# EAGLE design PiUnitTest (EAGLE 7.4.0)
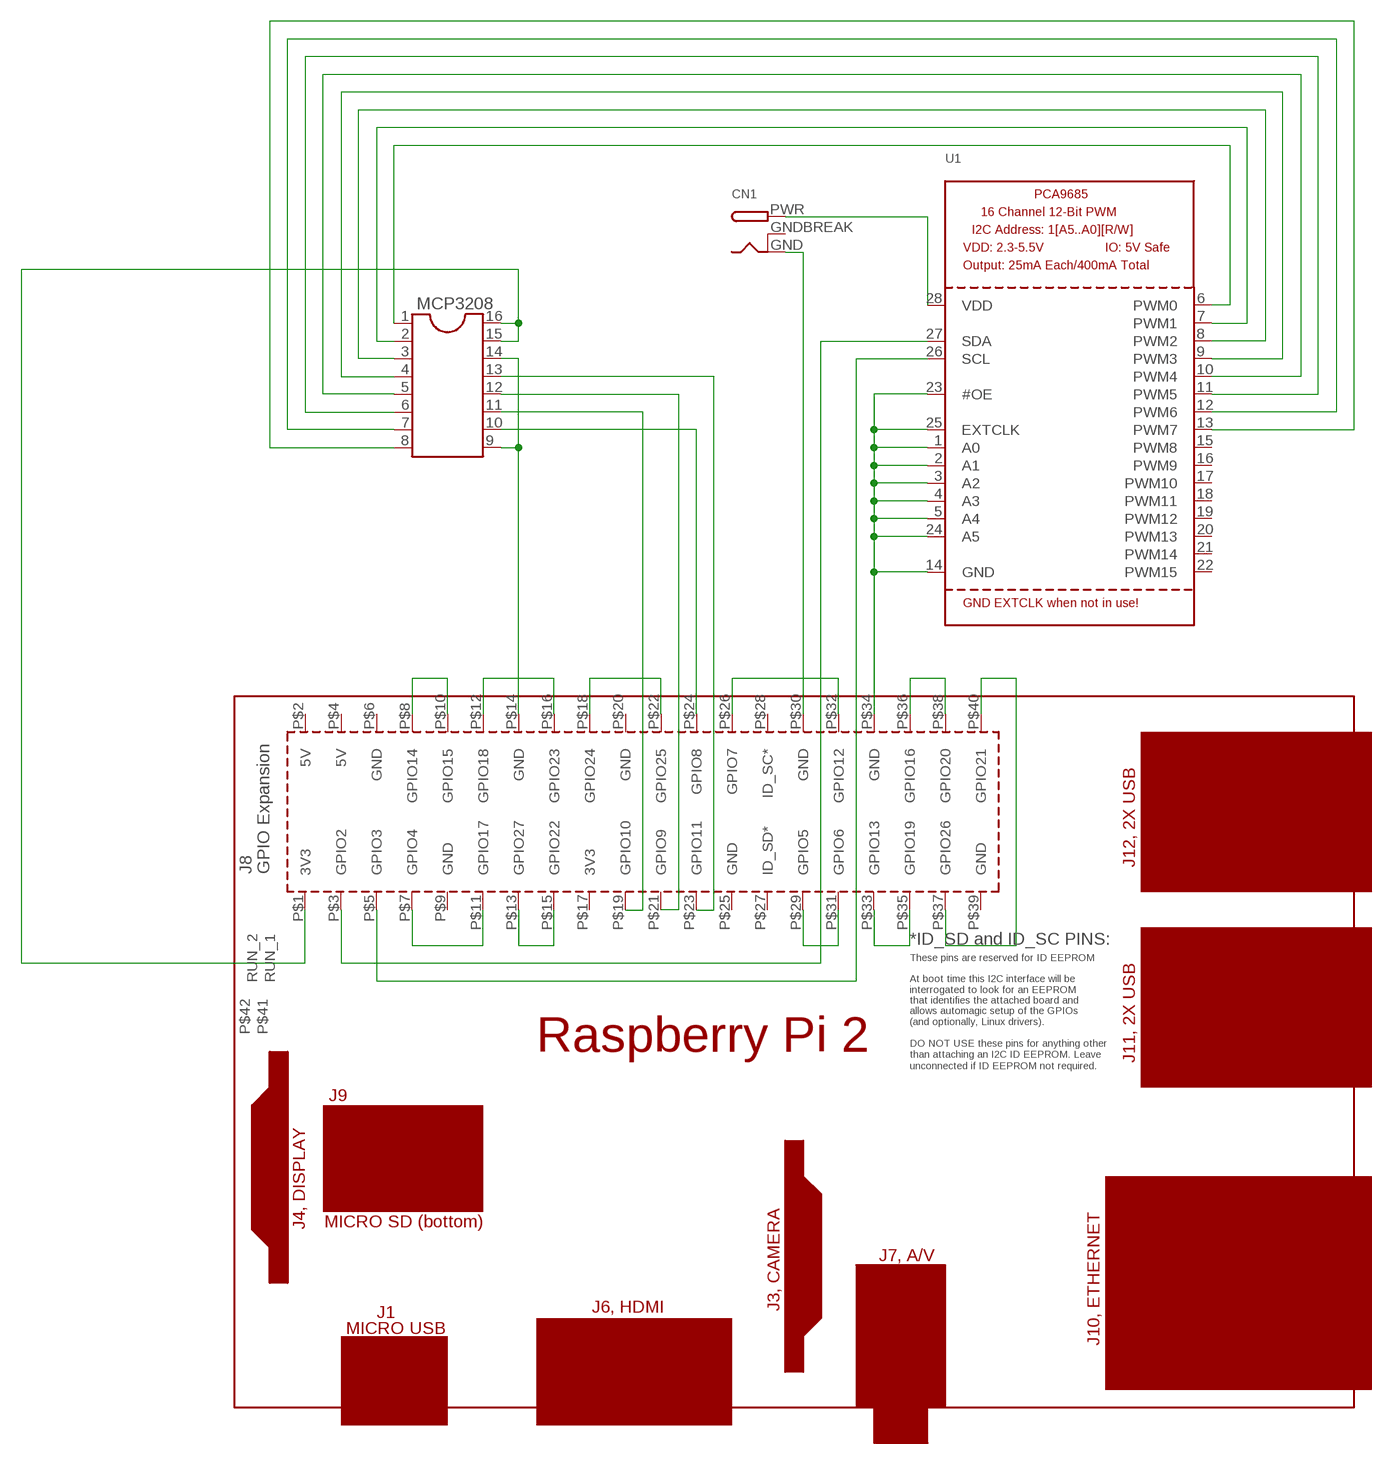
[diagram p0: schematic, sheet 1]

## Parts
CN1  DCBARRELPTH  [DCJACK_2MM_PTH]
MCP3208  DIL16  [DIL16]
PCB1  RPI2  [RPI2]
U1  PCA9685  [TSSOP28]

## Nets
N$1: CN1.GND PCB1.P$30(GND)
N$2: MCP3208.9 MCP3208.14 PCB1.P$14(GND)
N$3: PCB1.P$34(GND) U1.1(A0) U1.2(A1) U1.3(A2) U1.4(A3) U1.5(A4) U1.14(GND) U1.23(#OE) U1.24(A5) U1.25(EXTCLK)
N$4: MCP3208.15 MCP3208.16 PCB1.P$1(3V3)
N$5: MCP3208.13 PCB1.P$23(GPIO11)
N$6: MCP3208.12 PCB1.P$21(GPIO9)
N$7: MCP3208.11 PCB1.P$19(GPIO10)
N$8: MCP3208.10 PCB1.P$24(GPIO8)
N$9: CN1.PWR U1.28(VDD)
N$10: PCB1.P$3(GPIO2) U1.27(SDA)
N$11: PCB1.P$5(GPIO3) U1.26(SCL)
N$12: MCP3208.1 U1.6(PWM0)
N$13: MCP3208.2 U1.7(PWM1)
N$14: MCP3208.3 U1.8(PWM2)
N$15: MCP3208.4 U1.9(PWM3)
N$16: MCP3208.5 U1.10(PWM4)
N$17: MCP3208.6 U1.11(PWM5)
N$18: MCP3208.7 U1.12(PWM6)
N$19: MCP3208.8 U1.13(PWM7)
N$20: PCB1.P$7(GPIO4) PCB1.P$11(GPIO17)
N$21: PCB1.P$13(GPIO27) PCB1.P$15(GPIO22)
N$22: PCB1.P$29(GPIO5) PCB1.P$31(GPIO6)
N$23: PCB1.P$33(GPIO13) PCB1.P$35(GPIO19)
N$24: PCB1.P$37(GPIO26) PCB1.P$40(GPIO21)
N$25: PCB1.P$36(GPIO16) PCB1.P$38(GPIO20)
N$26: PCB1.P$26(GPIO7) PCB1.P$32(GPIO12)
N$27: PCB1.P$18(GPIO24) PCB1.P$22(GPIO25)
N$28: PCB1.P$12(GPIO18) PCB1.P$16(GPIO23)
N$29: PCB1.P$8(GPIO14) PCB1.P$10(GPIO15)
Unconnected: PCB1.P$2(5V) PCB1.P$4(5V) PCB1.P$6(GND) PCB1.P$9(GND) PCB1.P$17(3V3) PCB1.P$20(GND) PCB1.P$25(GND) PCB1.P$27(ID_SD*) PCB1.P$28(ID_SC*) PCB1.P$39(GND) PCB1.P$41(RUN_1) PCB1.P$42(RUN_2) U1.15(PWM8) U1.16(PWM9) U1.17(PWM10) U1.18(PWM11) U1.19(PWM12) U1.20(PWM13) U1.21(PWM14) U1.22(PWM15)

## Power pins joined to a net without a drawn wire
GNDBREAK: CN1.GNDBREAK

## Library data of the parts
CN1 = adafruit:DCBARREL: 2.0mm DC Barrel Jack DCJACK_2MM_PTH - Through Hole Jack (4UConnector: 05537)
MCP3208 = ic-package:DIL16: Dual In Line / Socket
PCB1 = e14_Rpi2_RevA:RPI2: Device for Raspberry Pi 2 board created by www.element14.com More information and support community is available at http://www.element14.com/community/community/raspberry-pi/raspberrypi2
U1 = adafruit:PCA9685: PCA9685 - 16 Channel 12-Bit I2C PWM Controller 5.0V tolerant 16 channel, 12-bit I2C PWM controller with 25mA per output (max. 400mA total) Digikey: 568-5931-1-ND

## Board
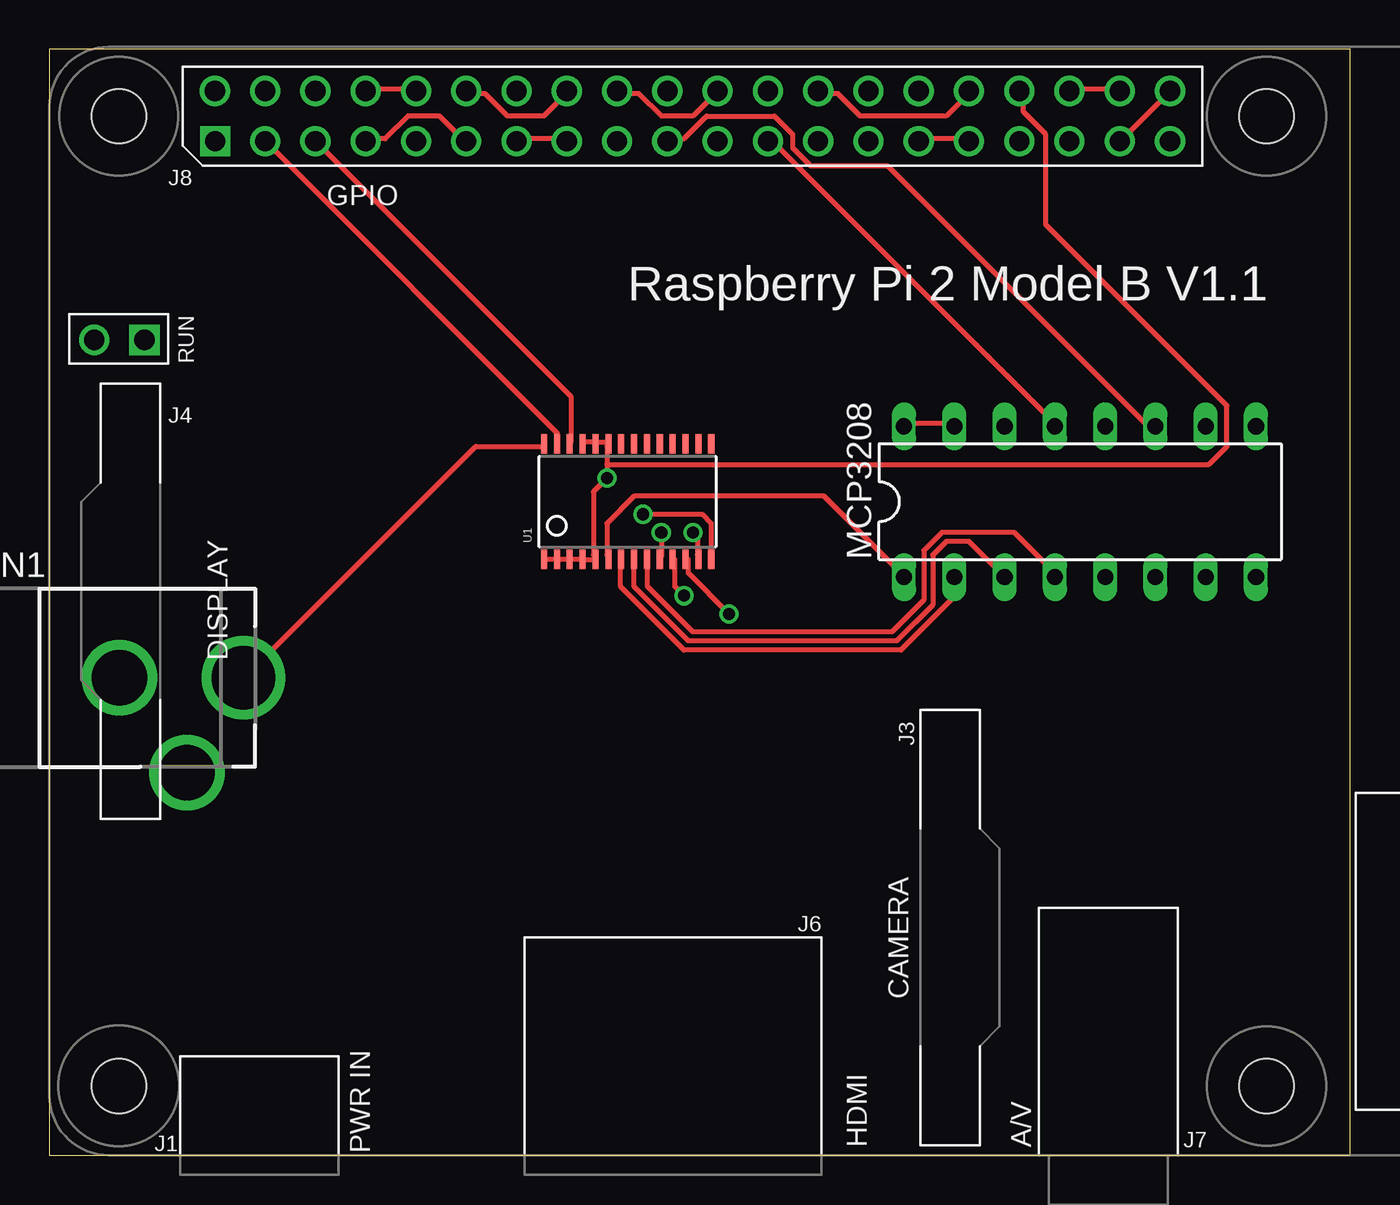
[diagram p1: board, top side]
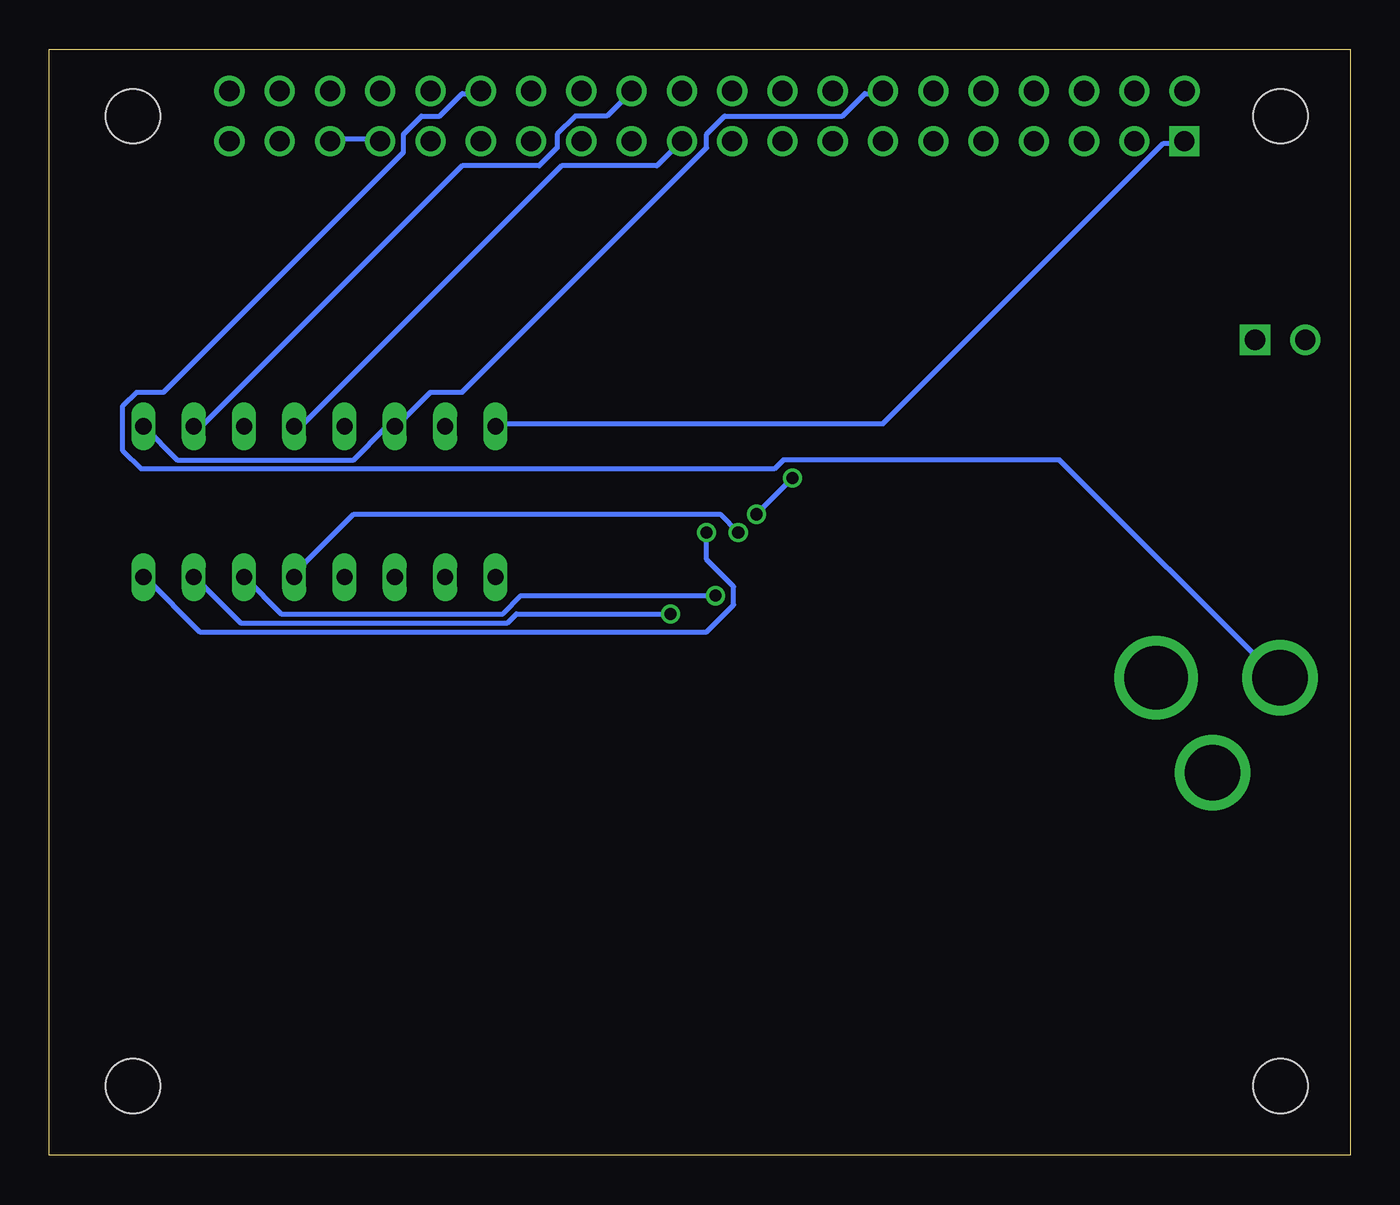
[diagram p2: board, bottom side, seen from below]

Size 65.71 x 55.87 mm. Coordinates in mm from the lower left corner, seen from the top.
Outline: 0,0 65.71,0 65.71,55.87 0,55.87 0,0
Copper layers (1*16): Top 0.0356mm / dielectric 1.5011mm / Bottom 0.0356mm
Design rules "LaenPCBOrder": minimum track width 6mil, minimum drill 13mil, track to track 6mil, track to pad 6mil, pad to pad 6mil, via to via 6mil, smd to smd 6mil, copper to edge 15mil, drill to drill 6mil, minimum pad ring 7mil, minimum via ring 7mil, stop-mask expansion 3mil, vias tented up to drill 0mil, thermal gap 10mil

### Footprints (pad centres in the part's own frame; a part is rotated, then mirrored left to right if it is on the bottom)
DCJACK_2MM_PTH = drill 2.8: GND 0,7.35; GNDBREAK 4.8,10.75 | drill 3.2: PWR 0,13.6
DIL16 = drill 0.813 long: 1 -8.89,-3.81; 2 -6.35,-3.81; 3 -3.81,-3.81; 4 -1.27,-3.81; 5 1.27,-3.81; 6 3.81,-3.81; 7 6.35,-3.81; 8 8.89,-3.81; 9 8.89,3.81; 10 6.35,3.81; 11 3.81,3.81; 12 1.27,3.81; 13 -1.27,3.81; 14 -3.81,3.81; 15 -6.35,3.81; 16 -8.89,3.81
RPI2 = drill 1.016 square: P$1 8.37,51.23; P$41 4.8,41.2 | drill 1.016: P$2 8.357,53.772; P$3 10.897,51.232; P$4 10.897,53.772; P$5 13.437,51.232; P$6 13.437,53.772; P$7 15.977,51.232; P$8 15.977,53.772; P$9 18.517,51.232; P$10 18.517,53.772; P$11 21.057,51.232; P$12 21.057,53.772; P$13 23.597,51.232; P$14 23.597,53.772; P$15 26.137,51.232; P$16 26.137,53.772; P$17 28.677,51.232; P$18 28.677,53.772; P$19 31.217,51.232; P$20 31.217,53.772; P$21 33.757,51.232; P$22 33.757,53.772; P$23 36.297,51.232; P$24 36.297,53.772; P$25 38.837,51.232; P$26 38.837,53.772; P$27 41.377,51.232; P$28 41.377,53.772; P$29 43.917,51.232; P$30 43.917,53.772; P$31 46.457,51.232; P$32 46.457,53.772; P$33 48.997,51.232; P$34 48.997,53.772; P$35 51.537,51.232; P$36 51.537,53.772; P$37 54.077,51.232; P$38 54.077,53.772; P$39 56.617,51.232; P$40 56.617,53.772; P$42 2.26,41.2 | hole 2.75: 3.5,3.5; 61.5,3.5; 3.5,52.5; 61.5,52.5
TSSOP28 = smd 0.305 x 0.991: 1 -4.225,-2.918; 2 -3.575,-2.918; 3 -2.925,-2.918; 4 -2.275,-2.918; 5 -1.625,-2.918; 6 -0.975,-2.918; 7 -0.325,-2.918; 8 0.325,-2.918; 9 0.975,-2.918; 10 1.625,-2.918; 11 2.275,-2.918; 12 2.925,-2.918; 13 3.575,-2.918; 14 4.225,-2.918; 15 4.225,2.918; 16 3.575,2.918; 17 2.925,2.918; 18 2.275,2.918; 19 1.625,2.918; 20 0.975,2.918; 21 0.325,2.918; 22 -0.325,2.918; 23 -0.975,2.918; 24 -1.625,2.918; 25 -2.275,2.918; 26 -2.925,2.918; 27 -3.575,2.918; 28 -4.225,2.918

### Placement (x,y rotation side)
CN1  -3.81,24.13 270 top
MCP3208  52.07,33.02 0 top
PCB1  0,0 0 top
U1  29.21,33.02 0 top

### Tracks (layer width: path | path; a pad name or v marks a point on that pad's centre or on a via)
N$1
  Bottom 0.254: PCB1.P$30 43.94,53.65 44.86,53.65 46,52.5 46.91,52.5 47.83,51.59 47.83,50.67 59.94,38.56 61.32,38.56 62,37.87 62,35.59 61.09,34.67 29.08,34.67 28.63,35.13 14.68,35.13 3.71,24.15 CN1.GND
N$2
  Bottom 0.254: MCP3208.9 59.26,35.13 50.34,35.13 48.74,36.73 48.28,36.73 MCP3208.14 48.06,36.96 46.46,38.56 44.86,38.56 32.51,50.9 32.51,51.59 31.6,52.5 25.65,52.5 24.51,53.65 23.6,53.65 PCB1.P$14
N$3  (via drill 0.61)
  Top 0.254: 25.65,30.1 24.97,30.1 U1.1 | 26.34,30.1 26.8,30.1 U1.4 27.03,30.1 27.48,30.1 U1.5 27.48,30.33 27.48,33.53 v28.17,34.21 28.17,34.9 | 26.34,30.1 25.65,30.1 | 25.65,30.1 U1.2 | 26.34,30.1 U1.3 | U1.25 27.03,36.04 27.48,36.04 U1.24 27.71,36.04 28.17,36.04 U1.23 28.17,35.81 28.17,34.9 | v30,32.39 32.97,32.39 33.43,31.93 33.43,30.33 U1.14 | 28.17,34.9 58.57,34.9 59.49,35.81 59.49,37.87 50.34,47.02 50.34,51.59 49.2,52.73 49.2,53.65 PCB1.P$34
  Bottom 0.254: v28.17,34.21 v30,32.39
N$4
  Top 0.254: MCP3208.16 43.26,36.96 45.54,36.96 MCP3208.15
  Bottom 0.254: PCB1.P$1 8.51,51.13 9.42,51.13 23.6,36.96 43.03,36.96 MCP3208.16
N$5
  Top 0.254: MCP3208.13 50.8,36.96 36.4,51.36 PCB1.P$23
N$6
  Bottom 0.254: MCP3208.12 53.31,36.96 52.86,36.96 39.83,49.99 35.03,49.99 33.88,51.13 PCB1.P$21
N$7
  Top 0.254: MCP3208.11 55.83,36.96 55.37,36.96 42.34,49.99 38.46,49.99 37.54,50.9 37.54,51.59 36.63,52.5 33.2,52.5 32.05,51.36 31.37,51.36 PCB1.P$19
N$8
  Bottom 0.254: MCP3208.10 58.34,36.96 57.89,36.96 44.86,49.99 40.97,49.99 40.06,50.9 40.06,51.59 39.14,52.5 37.54,52.5 36.4,53.65 PCB1.P$24
N$9
  Top 0.254: U1.28 24.97,35.81 21.54,35.81 9.88,24.15 CN1.PWR
N$10
  Top 0.254: U1.27 25.65,36.04 25.65,36.5 11.02,51.13 PCB1.P$3
N$11
  Top 0.254: PCB1.P$5 26.34,38.33 26.34,36.04 U1.26
N$12
  Top 0.254: U1.6 28.17,30.33 28.17,31.93 29.54,33.3 39.14,33.3 43.03,29.41 MCP3208.1
N$13
  Top 0.254: U1.7 28.85,30.1 28.85,28.73 32.05,25.53 43.03,25.53 45.54,28.04 45.54,29.18 MCP3208.2
N$14
  Top 0.254: MCP3208.3 46.46,31.01 45.31,31.01 44.63,30.33 44.63,27.81 42.8,25.98 32.28,25.98 29.54,28.73 U1.8
N$15
  Top 0.254: U1.9 30.23,30.1 30.23,28.73 32.51,26.44 42.57,26.44 44.17,28.04 44.17,30.56 45.09,31.47 48.74,31.47 50.8,29.41 MCP3208.4
N$16  (via drill 0.61)
  Top 0.254: v30.91,31.47 30.91,30.33 U1.10
  Bottom 0.254: v30.91,31.47 31.83,32.39 50.34,32.39 53.31,29.41 MCP3208.5
N$17  (via drill 0.61)
  Top 0.254: v32.05,28.27 31.6,28.73 31.6,30.1 U1.11
  Bottom 0.254: v32.05,28.27 41.88,28.27 42.8,27.36 54,27.36 55.83,29.18 MCP3208.6
N$18  (via drill 0.61)
  Top 0.254: v34.34,27.36 32.28,29.41 32.28,30.1 U1.12
  Bottom 0.254: v34.34,27.36 42.11,27.36 42.57,26.9 56.06,26.9 58.34,29.18 MCP3208.7
N$19  (via drill 0.61)
  Top 0.254: v32.51,31.47 32.74,31.24 32.74,30.33 U1.13
  Bottom 0.254: v32.51,31.47 32.51,30.1 31.14,28.73 31.14,27.81 32.51,26.44 58.12,26.44 60.86,29.18 MCP3208.8
N$20
  Top 0.254: PCB1.P$7 16.05,51.36 16.97,51.36 18.11,52.5 19.71,52.5 20.85,51.36 PCB1.P$11
N$21
  Top 0.254: PCB1.P$13 23.6,51.36 26.11,51.36 PCB1.P$15
N$22
  Top 0.254: PCB1.P$29 43.94,51.36 46.46,51.36 PCB1.P$31
N$23
  Bottom 0.254: PCB1.P$33 49.2,51.36 51.49,51.36 PCB1.P$35
N$24
  Top 0.254: PCB1.P$37 54.23,51.36 56.52,53.65 PCB1.P$40
N$25
  Top 0.254: PCB1.P$36 51.71,53.87 54,53.87 PCB1.P$38
N$26
  Top 0.254: PCB1.P$26 38.91,53.65 39.83,53.65 40.97,52.5 45.31,52.5 46.46,53.65 PCB1.P$32
N$27
  Top 0.254: PCB1.P$18 28.85,53.65 29.77,53.65 30.91,52.5 32.51,52.5 33.66,53.65 PCB1.P$22
N$28
  Top 0.254: PCB1.P$12 21.08,53.65 22,53.65 23.14,52.5 24.97,52.5 26.11,53.65 PCB1.P$16
N$29
  Top 0.254: PCB1.P$8 16.05,53.87 18.34,53.87 PCB1.P$10